# EAGLE design PAC1932_Breakout (EAGLE 9.6.2)
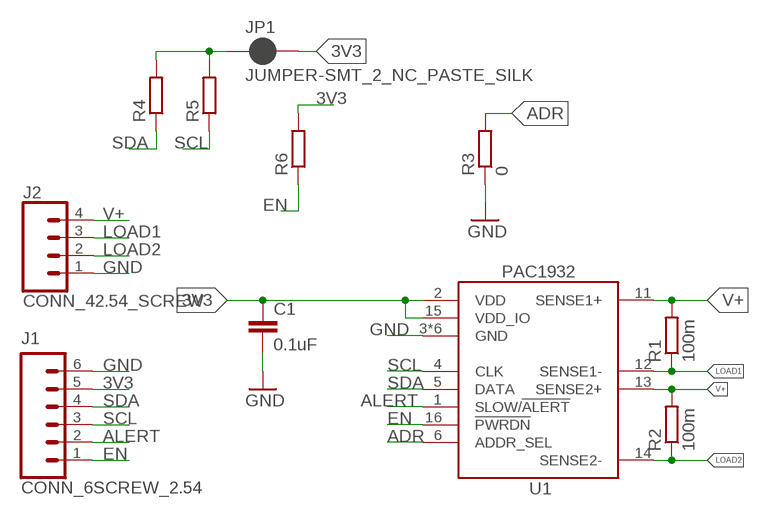
[diagram p0: schematic, sheet 1]

## Parts
C1  0.1uF  C-EU0.1UFC0402  [C0402]
J1  CONN_6SCREW_2.54  [1X06_SCREW]
J2  CONN_42.54_SCREW  [1X04_SCREW]
JP1  JUMPER-SMT_2_NC_PASTE_SILK  [SMT-JUMPER_2_NC_PASTE_SILK]
R1  100m  R-EU_0.1R0805  [R0805]
R2  100m  R-EU_0.1R0805  [R0805]
R3  0  R-EU_0.0R0402  [R0402]
R4  R-EU_10KR0402  [R0402]
R5  R-EU_10KR0402  [R0402]
R6  R-EU_10KR0402  [R0402]
U1  PAC1932QFN  [QFN16]

## Nets
3V3: C1.1 J1.5 JP1.2 R6.2 U1.2(VDD) U1.15(VDD_IO)
ADR: R3.2 U1.6(ADDR_SEL)
ALERT: J1.2 U1.1(SLOW/!ALERT)
EN: J1.1 R6.1 U1.16(!PWRDN)
GND: C1.2 J1.6 J2.1 R3.1 U1.3(GND) U1.7(GND) U1.8(GND) U1.9(GND) U1.10(GND) U1.EP(GND)
LOAD1: J2.3 R1.1 U1.12(SENSE1-)
LOAD2: J2.2 R2.1 U1.14(SENSE2-)
N$1: JP1.1 R4.2 R5.2
SCL: J1.3 R5.1 U1.4(CLK)
SDA: J1.4 R4.1 U1.5(DATA)
V+: J2.4 R1.2 R2.2 U1.11(SENSE1+) U1.13(SENSE2+)

## Library data of the parts
C1 = bschulz_passives:C-EU: CAPACITOR, European symbol; DIGIKEY: 490-4759-1-ND; MF: Murata; MPN: GCM155R71C104KA55D
J1 = bschulz:CONN_6: Genaric 6 terminal header Digikey 2.54_SCREW <https://www.digikey.com/product-detail/en/on-shore-technology-inc/OSTVN06A150/ED10565-ND/1588866>; DIGIKEY: ED10565-ND; MF: OnShore; MPN: OSTVN06A150
J2 = bschulz:CONN_4: Genaric 4 terminal header Digikey 2.54_SCREW <https://www.digikey.com/product-detail/en/on-shore-technology-inc/OSTVN04A150/ED10563-ND/1588864>; DIGIKEY: ED10563-ND; MF: On Shore; MPN: OSTVN04A150
JP1 = SparkFun-Jumpers:JUMPER-SMT_2_NC_PASTE: Normally closed solder jumper This jumper has an aperture in the stencil to allow solder paste to bridge the split in the wire so it's normally closed (NC). Wick off the solder to open the connection. Reapply solder to reclose the connection.
R1 R2 = bschulz_passives:R-EU_: RESISTOR, European symbol Digikey Parts: Yageo, 0402 <https://www.digikey.com/products/en/resistors/chip-resistor-surface-mount/52?k=&pkeyword=&sv=0&s=4356&sf=1&FV=-1%7C13%2C7%7C2%2C1291%7C39157%2C1989%7C0%2C-8%7C52%2C3%7C1131%2C3%7C2503&quantity=&ColumnSort=0&page=1&stock=1&pageSize=25> Yageo, 0603 <https://www.digikey.com/products/en/resistors/chip-resistor-surface-mount/52?k=&pkeyword=&sv=0&pv1291=39245&sf=1&FV=-5%7C4356%2C-5%7C47360%2C-8%7C52%2C-1%7C13%2C7%7C2%2C1989%7C0&quantity=10&ColumnSort=1000011&page=1&stock=1&pageSize=25> Panasonic, 0603 <https://www.digikey.com/products/en/resistors/chip-resistor-surface-mount/52?k=&pkeyword=&pv252=68&sf=0&FV=ffec373d%2C1c0002%2C142c040c%2C1f140000%2Cffe00034%2C80002%2Cc0001&quantity=&ColumnSort=0&page=1&stock=1&pageSize=25> Panasonic, precision, 0603 <https://www.digikey.com/products/en/resistors/chip-resistor-surface-mount/52?FV=ffec4907%2Cfffc000a%2Cc0172%2C142c040c%2C1f140000%2Cffe00034%2C1c0002&quantity=100&ColumnSort=2085&page=1&stock=1&pageSize=25> Panasonic, 0805 <https://www.digikey.com/products/en/resistors/chip-resistor-surface-mount/52?k=&pkeyword=&pv3=1&sf=0&FV=ffec373d%2C1c0002%2C1f140000%2Cffe00034%2C142c040d&quantity=&ColumnSort=0&page=1&stock=1&pageSize=25> Rohm, current sense <https://www.digikey.com/products/en/resistors/chip-resistor-surface-mount/52?k=&pkeyword=&pv3=1&sf=0&FV=ffecb688%2C1f140000%2Cffe00034%2C1c0002&quantity=&ColumnSort=0&page=1&stock=1&pageSize=25> Vishay, pulse proof automotive <https://www.digikey.com/products/en/resistors/chip-resistor-surface-mount/52?k=&pkeyword=&pv7=2&sf=0&FV=ffec5d6b%2Cffe00034%2C1f140000&quantity=&ColumnSort=0&page=1&stock=1&pageSize=25>; DIGIKEY: P19308CT-ND; MF: Panasonic; MPN: ERJ-6DSFR10V
R3 = bschulz_passives:R-EU_: RESISTOR, European symbol Digikey Parts: Yageo, 0402 <https://www.digikey.com/products/en/resistors/chip-resistor-surface-mount/52?k=&pkeyword=&sv=0&s=4356&sf=1&FV=-1%7C13%2C7%7C2%2C1291%7C39157%2C1989%7C0%2C-8%7C52%2C3%7C1131%2C3%7C2503&quantity=&ColumnSort=0&page=1&stock=1&pageSize=25> Yageo, 0603 <https://www.digikey.com/products/en/resistors/chip-resistor-surface-mount/52?k=&pkeyword=&sv=0&pv1291=39245&sf=1&FV=-5%7C4356%2C-5%7C47360%2C-8%7C52%2C-1%7C13%2C7%7C2%2C1989%7C0&quantity=10&ColumnSort=1000011&page=1&stock=1&pageSize=25> Panasonic, 0603 <https://www.digikey.com/products/en/resistors/chip-resistor-surface-mount/52?k=&pkeyword=&pv252=68&sf=0&FV=ffec373d%2C1c0002%2C142c040c%2C1f140000%2Cffe00034%2C80002%2Cc0001&quantity=&ColumnSort=0&page=1&stock=1&pageSize=25> Panasonic, precision, 0603 <https://www.digikey.com/products/en/resistors/chip-resistor-surface-mount/52?FV=ffec4907%2Cfffc000a%2Cc0172%2C142c040c%2C1f140000%2Cffe00034%2C1c0002&quantity=100&ColumnSort=2085&page=1&stock=1&pageSize=25> Panasonic, 0805 <https://www.digikey.com/products/en/resistors/chip-resistor-surface-mount/52?k=&pkeyword=&pv3=1&sf=0&FV=ffec373d%2C1c0002%2C1f140000%2Cffe00034%2C142c040d&quantity=&ColumnSort=0&page=1&stock=1&pageSize=25> Rohm, current sense <https://www.digikey.com/products/en/resistors/chip-resistor-surface-mount/52?k=&pkeyword=&pv3=1&sf=0&FV=ffecb688%2C1f140000%2Cffe00034%2C1c0002&quantity=&ColumnSort=0&page=1&stock=1&pageSize=25> Vishay, pulse proof automotive <https://www.digikey.com/products/en/resistors/chip-resistor-surface-mount/52?k=&pkeyword=&pv7=2&sf=0&FV=ffec5d6b%2Cffe00034%2C1f140000&quantity=&ColumnSort=0&page=1&stock=1&pageSize=25>; DIGIKEY: 311-0.0JRCT-ND; MF: Yageo; MPN: RC0402JR-070RL; VALUE_PART: 0
R4-R6 = bschulz_passives:R-EU_: RESISTOR, European symbol Digikey Parts: Yageo, 0402 <https://www.digikey.com/products/en/resistors/chip-resistor-surface-mount/52?k=&pkeyword=&sv=0&s=4356&sf=1&FV=-1%7C13%2C7%7C2%2C1291%7C39157%2C1989%7C0%2C-8%7C52%2C3%7C1131%2C3%7C2503&quantity=&ColumnSort=0&page=1&stock=1&pageSize=25> Yageo, 0603 <https://www.digikey.com/products/en/resistors/chip-resistor-surface-mount/52?k=&pkeyword=&sv=0&pv1291=39245&sf=1&FV=-5%7C4356%2C-5%7C47360%2C-8%7C52%2C-1%7C13%2C7%7C2%2C1989%7C0&quantity=10&ColumnSort=1000011&page=1&stock=1&pageSize=25> Panasonic, 0603 <https://www.digikey.com/products/en/resistors/chip-resistor-surface-mount/52?k=&pkeyword=&pv252=68&sf=0&FV=ffec373d%2C1c0002%2C142c040c%2C1f140000%2Cffe00034%2C80002%2Cc0001&quantity=&ColumnSort=0&page=1&stock=1&pageSize=25> Panasonic, precision, 0603 <https://www.digikey.com/products/en/resistors/chip-resistor-surface-mount/52?FV=ffec4907%2Cfffc000a%2Cc0172%2C142c040c%2C1f140000%2Cffe00034%2C1c0002&quantity=100&ColumnSort=2085&page=1&stock=1&pageSize=25> Panasonic, 0805 <https://www.digikey.com/products/en/resistors/chip-resistor-surface-mount/52?k=&pkeyword=&pv3=1&sf=0&FV=ffec373d%2C1c0002%2C1f140000%2Cffe00034%2C142c040d&quantity=&ColumnSort=0&page=1&stock=1&pageSize=25> Rohm, current sense <https://www.digikey.com/products/en/resistors/chip-resistor-surface-mount/52?k=&pkeyword=&pv3=1&sf=0&FV=ffecb688%2C1f140000%2Cffe00034%2C1c0002&quantity=&ColumnSort=0&page=1&stock=1&pageSize=25> Vishay, pulse proof automotive <https://www.digikey.com/products/en/resistors/chip-resistor-surface-mount/52?k=&pkeyword=&pv7=2&sf=0&FV=ffec5d6b%2Cffe00034%2C1f140000&quantity=&ColumnSort=0&page=1&stock=1&pageSize=25>; DIGIKEY: 311-10.0KLRCT-ND; MF: Yageo; MPN: RC0402FR-0710KL; VALUE_PART: 10k
U1 = bschulz:PAC1932: PAC1932 - High Side Current/Power Monitor with I2C Interface and Accumulator Characteristics: Vcc: 2.7V ~ 5.5V Iq: 5uA (Sleep) 0.1μA (Power Down) Common Mode Range: 0V ~ 40V Operating Temperature: -40°C to 85°C Digikey: PAC1932T-I/JQCT-ND (QFN) <https://www.digikey.com/product-detail/en/microchip-technology/PAC1932T-I-JQ/PAC1932T-I-JQCT-ND/9453207>; DIGIKEY: PAC1932T-I/JQCT-ND; MF: Microchip; MPN: PAC1932T-I/JQ

## Board
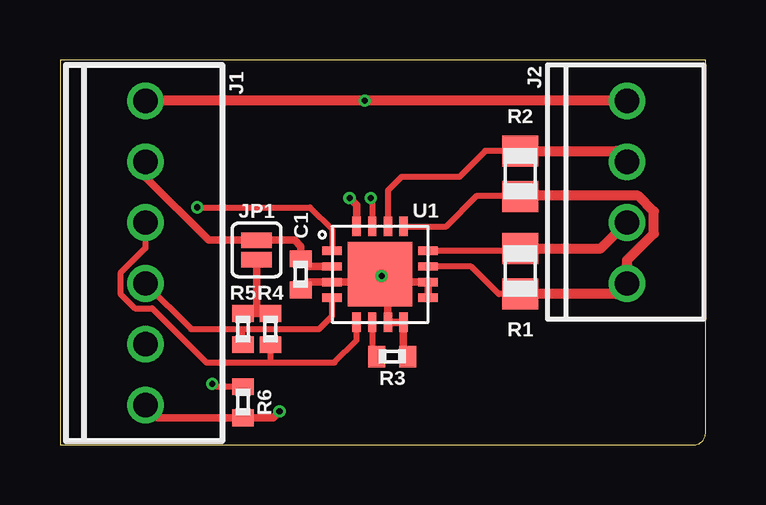
[diagram p1: board, top side]
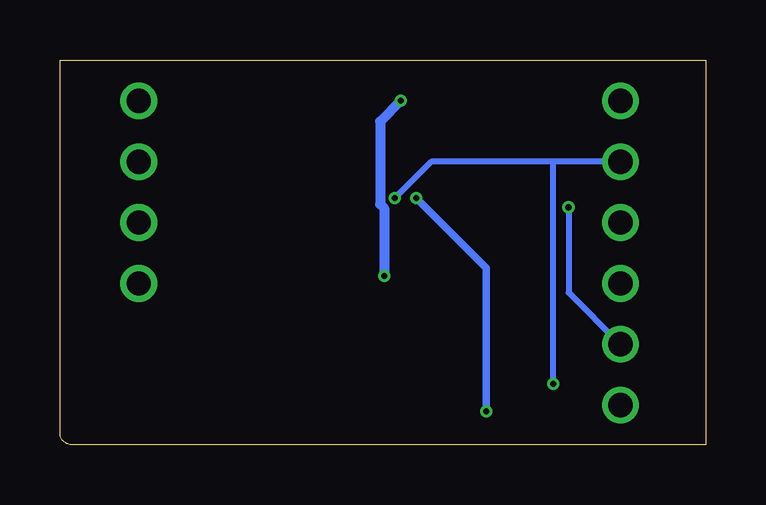
[diagram p2: board, bottom side, seen from below]

Size 26.9 x 16.05 mm. Coordinates in mm from the lower left corner, seen from the top.
Outline: 0,0 26.4,0 arc90 26.9,0.5 26.9,16.05 0,16.05 0,0
Copper layers (1*16): Top 0.035559375mm / dielectric 1.6mm / Bottom 0.035559375mm
Design rules "oshpark-2layer": minimum track width 6mil, minimum drill 10mil, track to track 6mil, track to pad 6mil, pad to pad 6mil, via to via 6mil, smd to smd 6mil, copper to edge 15mil, drill to drill 6mil, minimum pad ring 5mil, minimum via ring 5mil, stop-mask expansion 2.5mil, vias tented up to drill 0mil, thermal gap 10mil

### Footprints (pad centres in the part's own frame; a part is rotated, then mirrored left to right if it is on the bottom)
C0402 = smd 0.7 x 0.9: 1 -0.65,0; 2 0.65,0
1X06_SCREW = drill 1.016: 1 -6.35,0; 2 -3.81,0; 3 -1.27,0; 4 1.27,0; 5 3.81,0; 6 6.35,0
1X04_SCREW = drill 1.016: 1 -3.81,0; 2 -1.27,0; 3 1.27,0; 4 3.81,0
SMT-JUMPER_2_NC_PASTE_SILK = smd 0.635 x 1.27: 1 -0.406,0; 2 0.406,0
R0805 = smd 1.3 x 1.5: 1 -0.95,0; 2 0.95,0
R0402 = smd 0.7 x 0.9: 1 -0.65,0; 2 0.65,0
QFN16 = smd 0.8 x 0.35: 1 -2,0.975; 2 -2,0.325; 3 -2,-0.325; 4 -2,-0.975; 9 2,-0.975; 10 2,-0.325; 11 2,0.325; 12 2,0.975 | smd 0.35 x 0.8: 5 -0.975,-2; 6 -0.325,-2; 7 0.325,-2; 8 0.975,-2; 13 0.975,2; 14 0.325,2; 15 -0.325,2; 16 -0.975,2 | smd 2.7 x 2.7: EP 0,0

### Placement (x,y rotation side)
C1  10.03,7.11 270 top
J1  3.56,8 90 top
J2  23.62,10.54 270 top
JP1  8.19,8.13 90 top
R1  19.18,7.24 270 top
R2  19.18,11.3 270 top
R3  13.84,3.68 180 top
R4  8.76,4.83 90 top
R5  7.62,4.83 90 top
R6  7.62,1.78 90 top
U1  13.34,7.11 0 top

### Tracks (layer width: path | path; a pad name or v marks a point on that pad's centre or on a via)
3V3  (via drill 0.25)
  Top 0.254: R6.2 6.46,2.43 v6.35,2.54 | v12.95,10.29 13.01,10.23 U1.15
  Top 0.305: U1.2 10.36,7.44 C1.1 10.03,8.28 9.78,8.53 JP1.2 6.2,8.53 3.56,11.18 J1.5
  Bottom 0.254: J1.5 6.35,11.81 | 6.35,11.81 11.43,11.81 v12.95,10.29 | v6.35,2.54 6.35,11.81
ADR
  Top 0.254: U1.6 13.01,3.87 R3.2
ALERT  (via drill 0.25)
  Top 0.254: v5.71,9.91 10.41,9.91 11.34,8.98 U1.1
  Bottom 0.254: v5.71,9.91 5.71,6.35 J1.2
EN  (via drill 0.25)
  Top 0.305: J1.1 4.08,1.13 R6.1 8.88,1.13 v9.14,1.4 | v12.06,10.29 12.36,9.99 U1.16
  Bottom 0.305: v9.14,1.4 9.14,7.37 v12.06,10.29
GND  (via drill 0.25)
  Top 0.305: C1.2 10.36,6.79 U1.3 13.01,6.79 U1.EP v13.4,7.05 13.66,6.79 | U1.9 U1.10 13.66,6.79 | 13.66,6.79 U1.7 U1.8 14.31,3.87 R3.1
  Top 0.406: J2.1 v12.7,14.35 J1.6
  Bottom 0.406: v13.4,7.05 13.4,9.87 13.56,10.03 13.56,13.49 v12.7,14.35
LOAD1
  Top 0.254: R1.1 19.07,8.09 U1.12
  Top 0.406: R1.1 22.54,8.19 J2.3
LOAD2
  Top 0.254: R2.1 17.71,12.25 16.64,11.18 14.22,11.18 13.66,10.61 U1.14
  Top 0.406: R2.1 23.18,12.25 J2.2
N$1
  Top 0.305: R4.2 8.13,5.48 | 8.13,5.48 R5.2 | JP1.1 8.19,5.54 8.13,5.48
SCL
  Top 0.254: J1.3 5.46,4.83 7.62,4.83 | U1.4 11.34,5.37 10.79,4.83 7.62,4.83 | R5.1 7.62,4.83
SDA
  Top 0.254: J1.4 3.56,8.2 2.52,7.16 2.52,6.3 3.12,5.69 3.83,5.69 6.1,3.43 8.76,3.43 | U1.5 12.36,4.36 11.43,3.43 8.76,3.43 | R4.1 8.76,3.43
V+
  Top 0.254: R1.2 18.29,6.29 17.14,7.44 U1.11 | U1.13 16.1,9.11 17.37,10.39 19.21,10.39
  Top 0.406: R2.2 19.21,10.39 24.09,10.39 24.74,9.73 24.74,8.81 23.62,7.69 J2.4 23.18,6.29 R1.2

### Text on the board
tDocu: PAC1932 | B. Schulz / Break 44
bDocu: GND | GND | 3v3 | L2 | Load Connect | SDA | L1 | Data Out | SCL | Vin | ALRT | EN